# EAGLE design Zdroj (EAGLE 4.01)
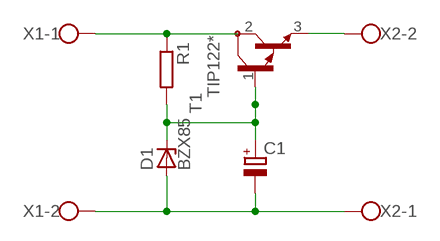
[diagram p0: schematic, sheet 1]

## Parts
C1  CPOL-EUE2.5-6  [E2,5-6]
D1  BZX85  [DO41Z10]
R1  R-EU_0207/10  [0207/10]
T1  TIP122*  [TO220V]
X1  AK500/2  [AK500/2]
X2  AK500/2  [AK500/2]

## Nets
N$1: T1.3(E) X2.2
N$2: R1.1 T1.2(C) X1.1
N$3: C1.- D1.A X1.2 X2.1
N$6: C1.+ D1.K(C) R1.2 T1.1(B)

## Library data of the parts
C1 = rcl:CPOL-EU: POLARIZED CAPACITOR, European symbol
D1 = diode:BZX85: Z DIODE
R1 = rcl:R-EU_: RESISTOR, European symbol
T1 = transistor-npn:TIP122: NPN BIPOLAR DARLINGTON TRANSISTOR
X1 X2 = con-ptr500:AK500/2: CONNECTOR

## Board
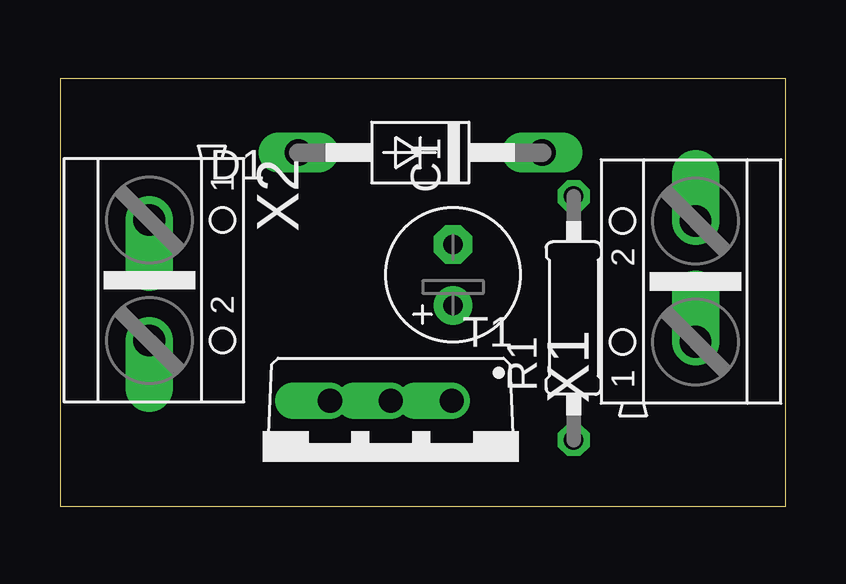
[diagram p1: board, top side]
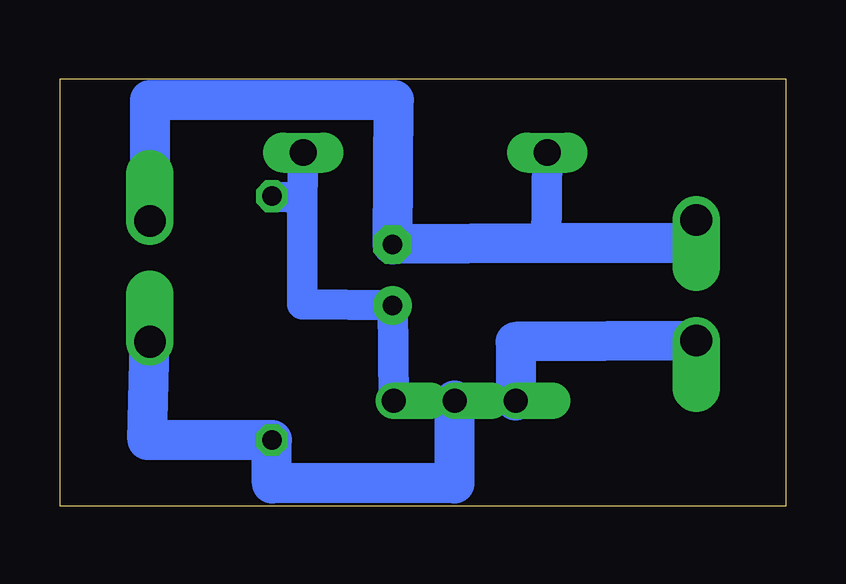
[diagram p2: board, bottom side, seen from below]

Size 30.23 x 17.81 mm. Coordinates in mm from the lower left corner, seen from the top.
Outline: 0,0 30.23,0 30.23,17.81 0,17.81 0,0
Copper layers used: Bottom

### Footprints (pad centres in the part's own frame; a part is rotated, then mirrored left to right if it is on the bottom)
E2,5-6 = drill 0.813 pad 1.6 round: + -1.27,0 | drill 0.813 pad 1.6 octagon: - 1.27,0
DO41Z10 = drill 1.118 long: A 5.08,0; K -5.08,0
0207/10 = drill 0.813 octagon: 1 -5.08,0; 2 5.08,0
TO220V = drill 1.016 offset: 1 -2.54,-2.54; 2 0,-2.54; 3 2.54,-2.54
AK500/2 = drill 1.321 offset: 1 -2.515,0; 2 2.515,0

### Placement (x,y rotation side)
C1  16.38,9.64 90 top
D1  15.01,14.73 180 top
R1  21.4,7.83 90 top
T1  13.78,1.85 180 top
X1  26.48,9.36 90 top
X2  3.72,9.41 270 top

### Tracks (layer width: path | path; a pad name or v marks a point on that pad's centre or on a via)
N$1
  Bottom 1.676: X2.2 11.24,6.84 T1.3
N$2
  Bottom 1.676: X1.1 26.59,2.75 R1.1 21.4,0.95 13.78,0.95 T1.2
N$3
  Bottom 1.27: 9.97,10.96 D1.A
  Bottom 1.676: X2.1 3.8,10.96 9.97,10.96 C1.- 16.32,16.91 26.48,16.91 X1.2
N$6
  Bottom 1.27: T1.1 C1.+ 20.13,8.42 20.13,12.84 | 20.13,12.84 D1.K | 20.13,12.84 R1.2